# Altium project NearField_PCB_Probes.PrjPcb
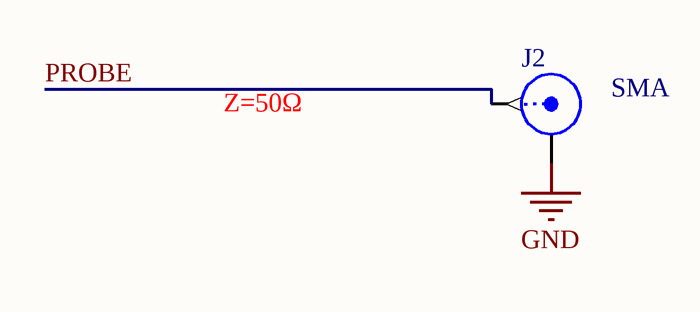
[diagram p0: NearField_E_Probe.SchDoc]
1 sheet, 1 parts. Net scope: global (net labels, ports and power ports of the same name join across sheets).
Board file: NearField_PCB_Probes.PcbDoc

## Sheet NearField_E_Probe.SchDoc
size A4

### Parts
J2  SMA  [SMA Edge Launch (Horizontal)]

### Nets
GND: J2.2(Y)
PROBE: J2.1(X)

### Notes on the sheet
- Z=50Ω

### Library data of the parts
J2 = SMA: SMA Connector; Supplier 1: Digi-Key; Supplier Part Number 1: A97594-ND